# Altium schematic sheet Sheet2.SchDoc
size A0; SheetNumber: 1; SheetTotal: 1
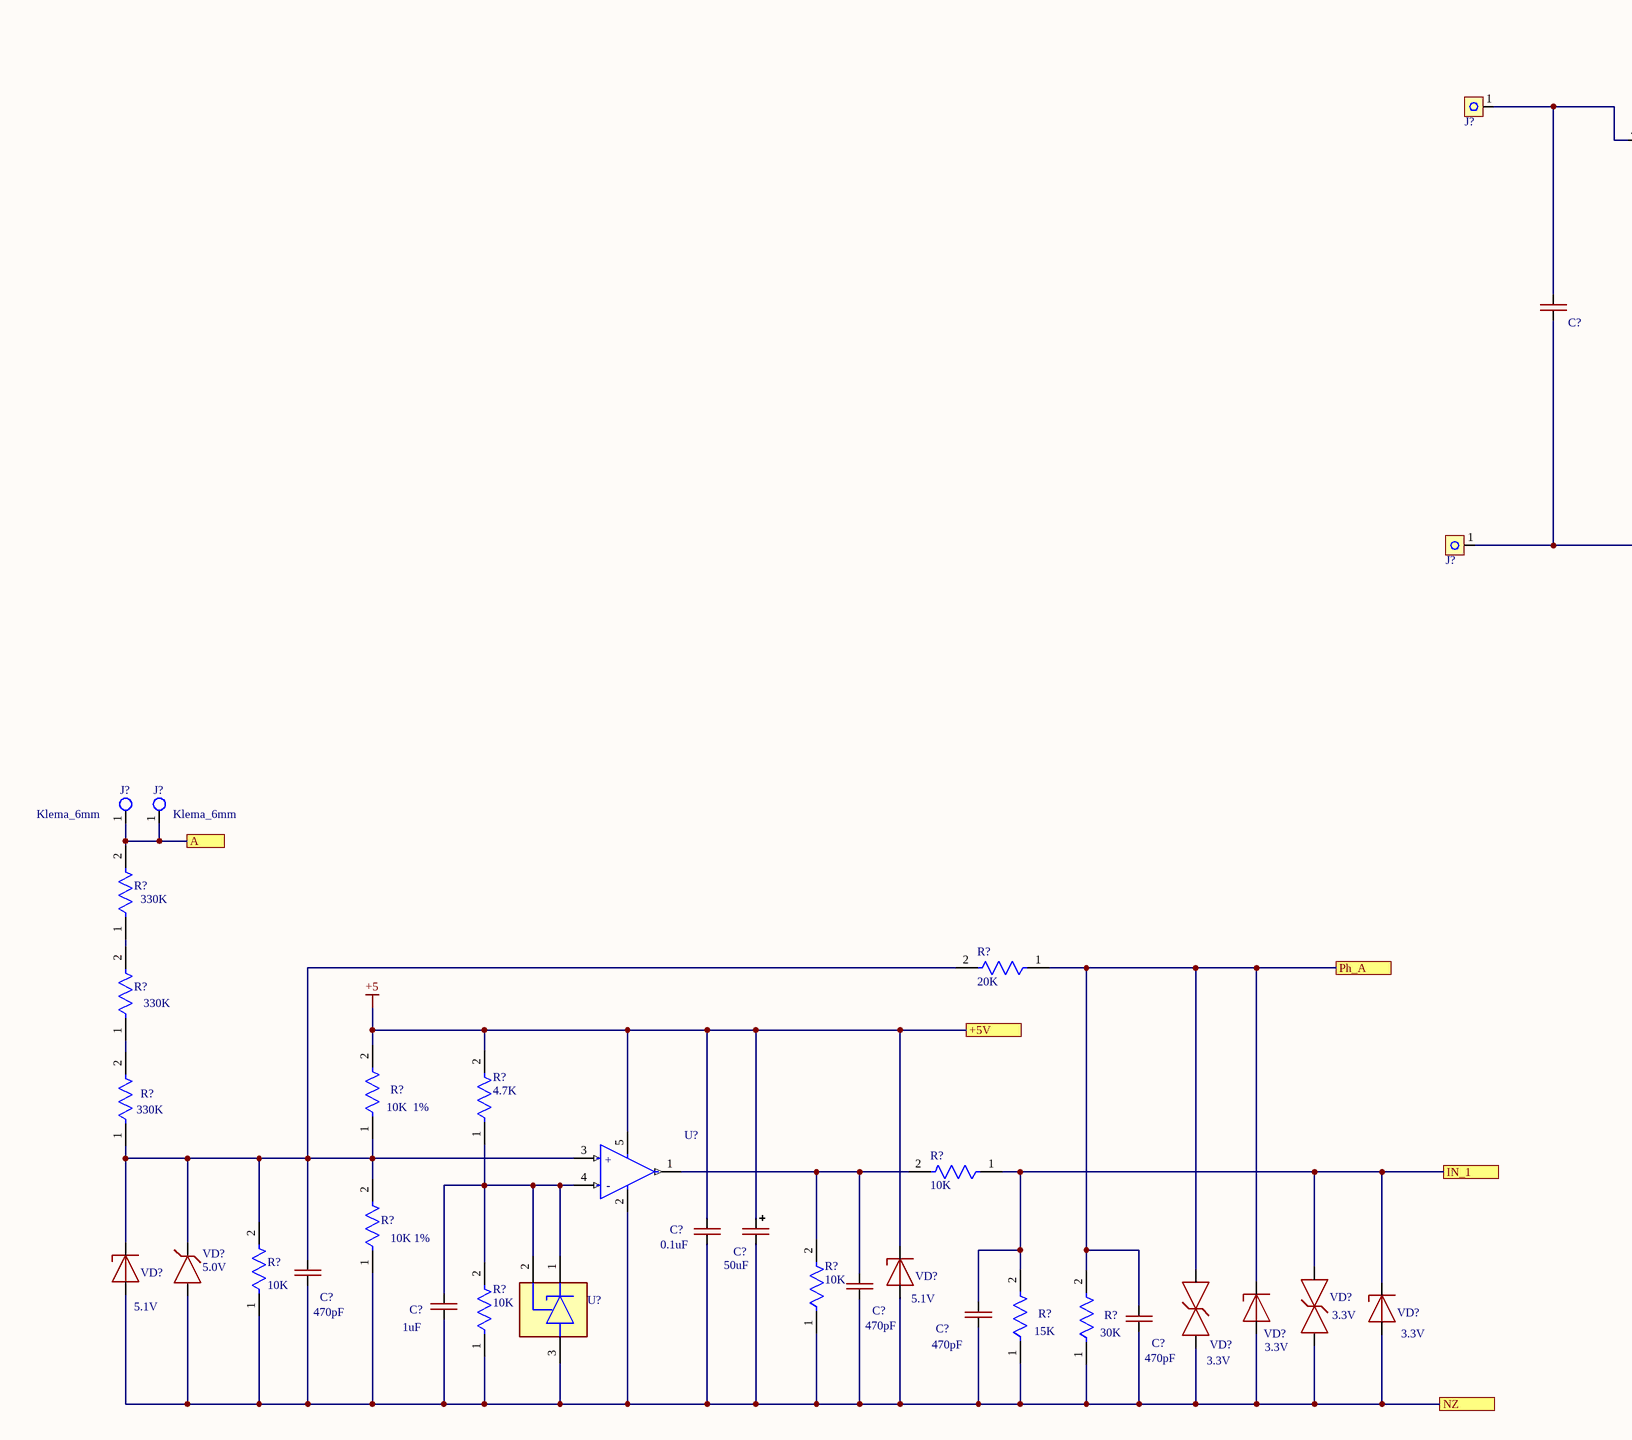
[diagram p0: Sheet2.SchDoc, left]
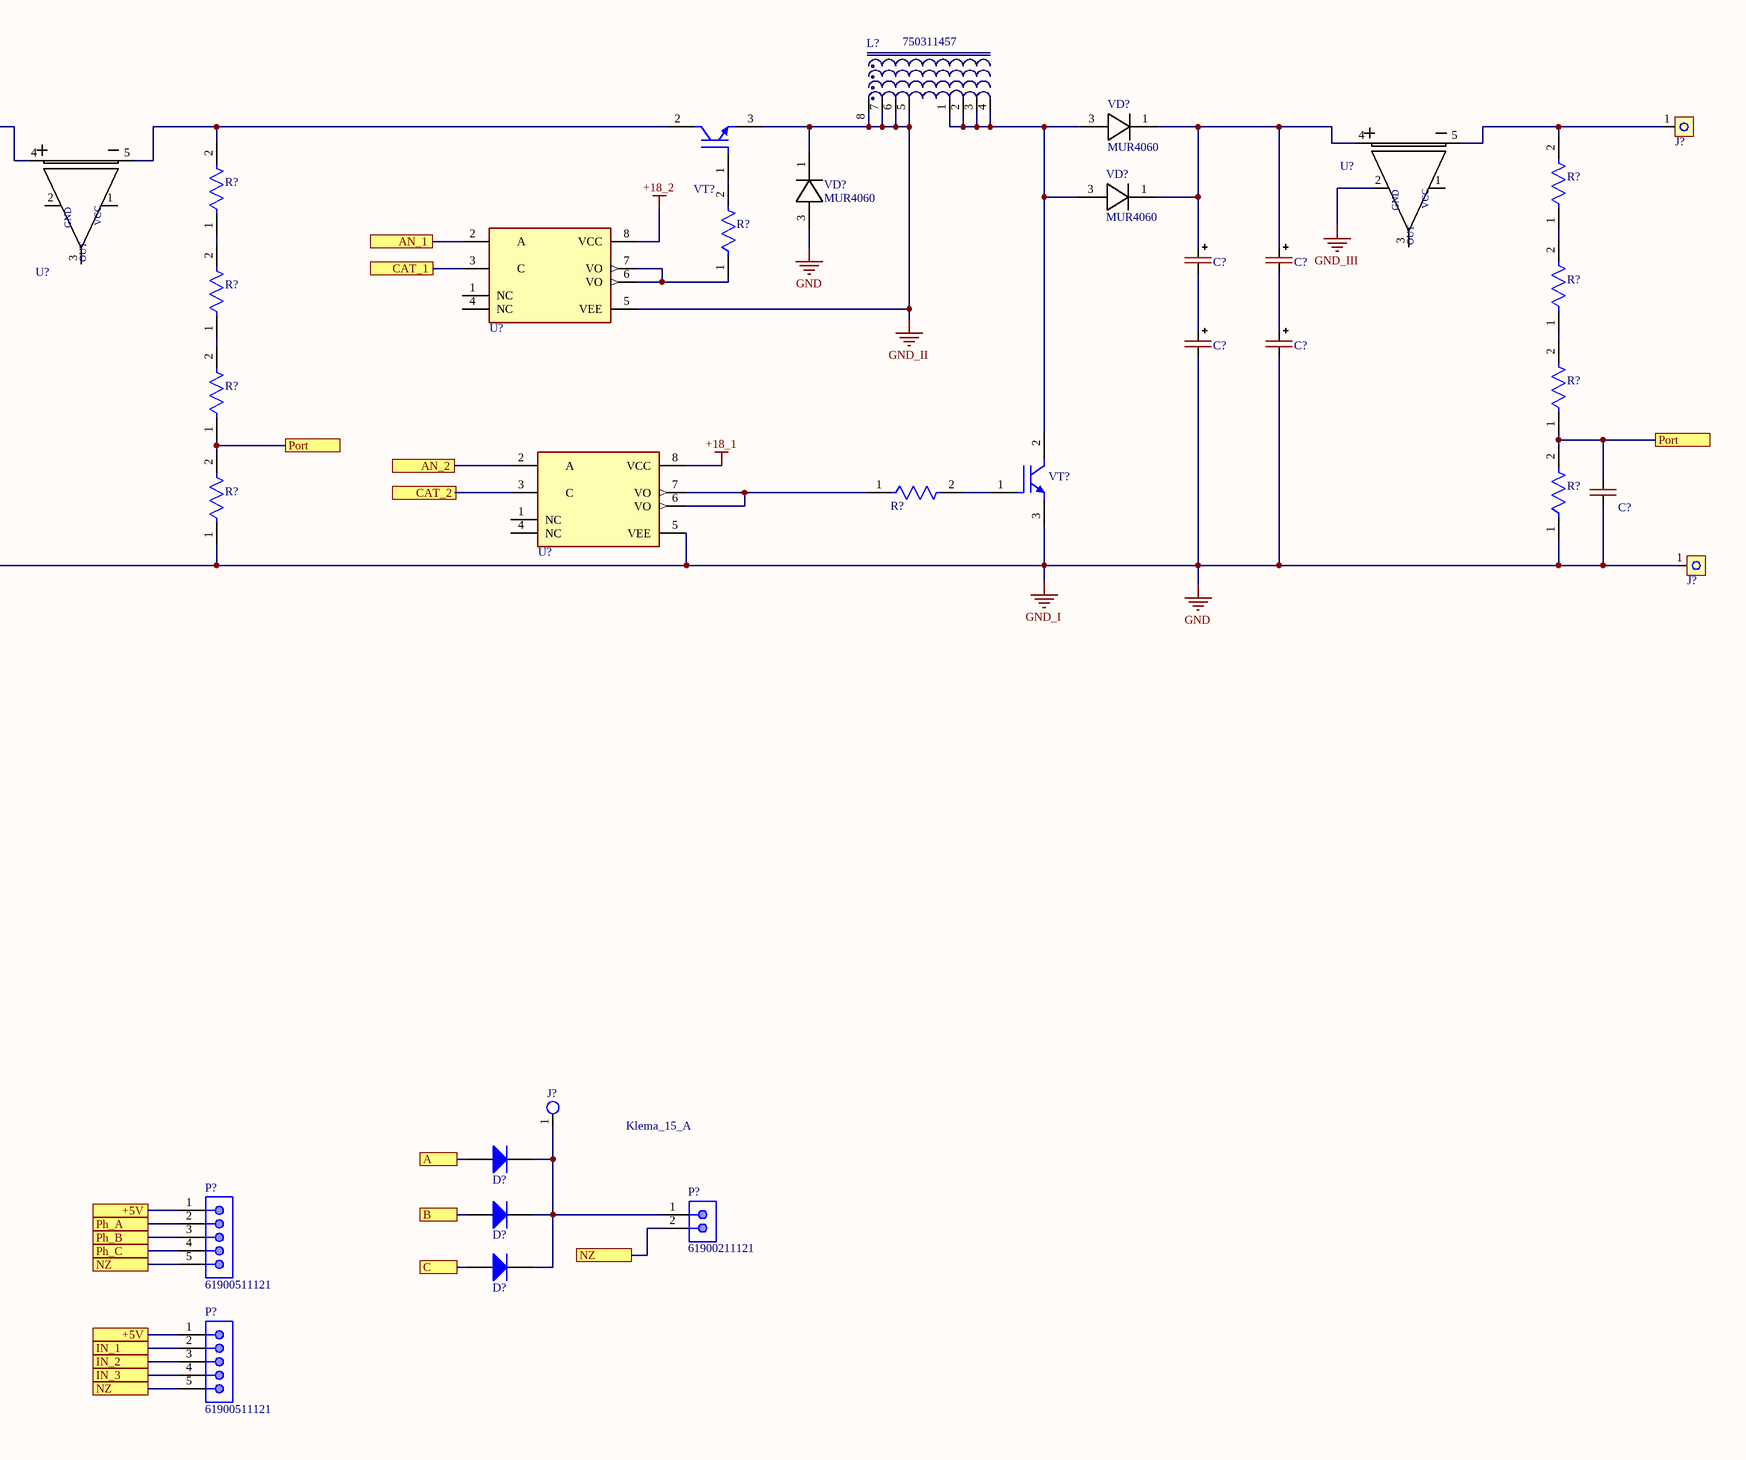
[diagram p1: Sheet2.SchDoc, right]

## Parts
(Parts that share a designator on the sheet are numbered #1, #2 ... from top to bottom, then left to right.)
C?#1  CAP-POLAR  [CAP 100uF_500V 22x40mm]  (value not drawn)
C?#2  CAP-POLAR  [CAP 100uF_500V 22x40mm]  (value not drawn)
C?#3  CAP-NON-POLAR  [CAP_4.7uF_630V]  (value not drawn)
C?#4  CAP-POLAR  [CAP 100uF_500V 22x40mm]  (value not drawn)
C?#5  CAP-POLAR  [CAP 100uF_500V 22x40mm]  (value not drawn)
C?#6  CAP-NON-POLAR  [CAP-0805]  (value not drawn)
C?#7  0.1uF  [CAP-0805]
C?#8  50uF  [CAP-TAN-D]
C?#9  470pF  [CAP-0805]
C?#10  470pF  [CAP-0805]
C?#11  1uF  [CAP-0805]
C?#12  470pF  [CAP-0805]
C?#13  470pF  [CAP-0805]
D?#1  FR-207  [FP-DO-201AD-MFG]  (value not drawn)
D?#2  FR-207  [FP-DO-201AD-MFG]  (value not drawn)
D?#3  FR-207  [FP-DO-201AD-MFG]  (value not drawn)
J?#1  MG_136_HT  [Conn_MEIGAN_MG136HT]  (value not drawn)
J?#2  MG_136_HT  [Conn_MEIGAN_MG136HT]  (value not drawn)
J?#3  MG_136_HT  [Conn_MEIGAN_MG136HT]  (value not drawn)
J?#4  MG_136_HT  [Conn_MEIGAN_MG136HT]  (value not drawn)
J?#5  Klema_6mm  [Connector_6mm]
J?#6  Klema_6mm  [Connector_6mm]
J?#7  Klema_15_A  [Klema_PCB_15A]
L?  750311457  [Drossel]
P?#1  61900511121  [61900511121]
P?#2  61900211121  [61900211121]
P?#3  61900511121  [61900511121]
R?#1  RES_1210  [RES_SMD_1210_IPC_B]  (value not drawn)
R?#2  RES_1210  [RES_SMD_1210_IPC_B]  (value not drawn)
R?#3  RES_1210  [RES_SMD_1210_IPC_B]  (value not drawn)
R?#4  RES_1210  [RES_SMD_1210_IPC_B]  (value not drawn)
R?#5  RES_1210  [RES_SMD_1210_IPC_B]  (value not drawn)
R?#6  RES_1210  [RES_SMD_1210_IPC_B]  (value not drawn)
R?#7  RES_1210  [RES_SMD_1210_IPC_B]  (value not drawn)
R?#8  RES_1210  [RES_SMD_1210_IPC_B]  (value not drawn)
R?#9  RES_1210  [RES_SMD_1210_IPC_B]  (value not drawn)
R?#10  RES_1210  [RES_SMD_1210_IPC_B]  (value not drawn)
R?#11  330K  [RES_SMD_1210_IPC_B]
R?#12  20K  [RES-0805]
R?#13  330K  [RES_SMD_1210_IPC_B]
R?#14  10K  1%  [RES-0805]
R?#15  330K  [RES_SMD_1210_IPC_B]
R?#16  4.7K  [RES-0805]
R?#17  10K  [RES-0805]
R?#18  10K 1%  [RES-0805]
R?#19  10K  [RES_SMD_1210_IPC_B]
R?#20  10K  [RES-0805]
R?#21  10K  [RES-0805]
R?#22  15K  [RES-0805]
R?#23  30K  [RES-0805]
U?#1  HCPL-3120  [HCPL-3120]  (value not drawn)
U?#2  ACS758  [ACS758-100]  (value not drawn)
U?#3  ACS758  [ACS758-100]  (value not drawn)
U?#4  HCPL-3120  [HCPL-3120]  (value not drawn)
U?#5  (no value)  [SOT-23-5]
U?#6  TL431  [TL431_SOT-23-3(A)]  (value not drawn)
VD?#1  MUR4060  [TO-247-2]
VD?#2  MUR4060  [TO-247-2]
VD?#3  MUR4060  [TO-247-2]
VD?#4  5.0V  [SOD-323]
VD?#5  5.1V  [DIOD-SOD123-2_V]
VD?#6  5.1V  [DIOD-SOD123-2_V]
VD?#7  3.3V  [DO-214AA]
VD?#8  3.3V  [DO-214AA]
VD?#9  3.3V  [DIOD-SOD123-2_V]
VD?#10  3.3V  [DIOD-SOD123-2_V]
VT?#1  IGBT 60N120T  [TO-264-3]  (value not drawn)
VT?#2  IGBT 60N120T  [TO-264-3]  (value not drawn)

## Ports
+5V, A, AN_1, AN_2, B, C, CAT_1, CAT_2, IN_1, IN_2, IN_3, NZ, Ph_A, Ph_B, Ph_C, Port

## Nets
+5: C?#7.2 C?#8.1(+) P?#1.1 P?#3.1 R?#14.2 R?#16.2 U?#5.5(VDD) VD?#6.1(C) ; port +5V
+18_1: U?#4.8(VCC)
+18_2: U?#1.8(VCC)
GND: C?#3.1 C?#4.2(-) C?#5.2(-) C?#6.1 J?#3.1 J?#4.1 R?#9.1 R?#10.1 U?#4.5(VEE) VD?#3.3 VT?#2.3(E)  [also labelled GND_I]
GND_II: L?.5 L?.6 L?.7 L?.8 U?#1.5(VEE) VD?#3.1 VT?#1.3(E)
GND_III: U?#2.2(GND)
A: D?#1.2(A) J?#5.1 J?#6.1 R?#11.2 ; port A
AN_1: U?#1.2(A) ; port AN_1
AN_2: U?#4.2(A) ; port AN_2
B: D?#2.2(A) ; port B
C: D?#3.2(A) ; port C
CAT_1: U?#1.3(C) ; port CAT_1
CAT_2: U?#4.3(C) ; port CAT_2
IN_1: C?#12.2 P?#3.2 R?#17.1 R?#22.2 VD?#8.2(A) VD?#10.1(C) ; port IN_1
IN_2: P?#3.3 ; port IN_2
IN_3: P?#3.4 ; port IN_3
NZ: C?#7.1 C?#8.2(-) C?#9.1 C?#10.1 C?#11.1 C?#12.1 C?#13.1 P?#1.5 P?#2.2 P?#3.5 R?#18.1 R?#19.1 R?#20.1 R?#21.1 R?#22.1 R?#23.1 U?#5.2(VSS) U?#6.3(A) VD?#4.1(A) VD?#5.2(A) VD?#6.2(A) VD?#7.1(C) VD?#8.1(C) VD?#9.2(A) VD?#10.2(A) ; port NZ
Ph_A: C?#13.2 P?#1.2 R?#12.1 R?#23.2 VD?#7.2(A) VD?#9.1(C) ; port Ph_A
Ph_B: P?#1.3 ; port Ph_B
Ph_C: P?#1.4 ; port Ph_C
Port: C?#6.2 R?#6.1 R?#7.1 R?#9.2 R?#10.2 ; port Port
NetC?#1_1: C?#1.1(+) C?#2.1(+) U?#2.4(+IP) VD?#1.1 VD?#2.1
NetC?#1_2: C?#1.2(-) C?#4.1(+)
NetC?#2_2: C?#2.2(-) C?#5.1(+)
NetC?#3_2: C?#3.2 J?#1.1 U?#3.4(+IP)
NetC?#9_2: C?#9.2 R?#12.2 R?#14.1 R?#15.1 R?#18.2 R?#19.2 U?#5.3(VIN+) VD?#4.2(C) VD?#5.1(C)
NetC?#10_2: C?#10.2 R?#17.2 R?#20.2 U?#5.1(VOUT)
NetC?#11_2: C?#11.2 R?#16.1 R?#21.2 U?#5.4(VIN-) U?#6.1(C) U?#6.2(REF)
NetD?#1_1: D?#1.1(K) D?#2.1(K) D?#3.1(K) J?#7.1 P?#2.1
NetJ?#2_1: J?#2.1 R?#1.2 U?#2.5(-IP)
NetL?_1: L?.1 L?.2 L?.3 L?.4 VD?#1.3 VD?#2.3 VT?#2.2(C)
NetR?#1_1: R?#1.1 R?#5.2
NetR?#2_1: R?#2.1 R?#4.2
NetR?#2_2: R?#2.2 U?#3.5(-IP) VT?#1.2(C)
NetR?#3_1: R?#3.1 U?#1.6(VO) U?#1.7(VO)
NetR?#3_2: R?#3.2 VT?#1.1(G)
NetR?#4_1: R?#4.1 R?#6.2
NetR?#5_1: R?#5.1 R?#7.2
NetR?#8_1: R?#8.1 U?#4.6(VO) U?#4.7(VO)
NetR?#8_2: R?#8.2 VT?#2.1(G)
NetR?#11_1: R?#11.1 R?#13.2
NetR?#13_1: R?#13.1 R?#15.2

Not connected (* = marked no-connect by the designer): U?#1 1(NC) 4(NC); U?#2 1(+VCC) 3(OUT); U?#3 1(+VCC) 2(GND) 3(OUT); U?#4 1(NC) 4(NC)

## Notes on the sheet
- (in symbol ACS758) VCC
- (in symbol MCP6001T) +; -

## Library data of the parts
C?#7 C?#9-C?#13 = CAP-NON-POLAR
C?#8 = CAP-POLAR
D?#1-D?#3 = FR-207: FR207
J?#1-J?#4 = Connector_MEIGAN_MG136HT
J?#5 J?#6 = Klema_15_A
L? = DROSEL: Manufacturer: Wuerth Elektronik; Ui: 36V; ComponentLink1Description: Manufacturer URL; ComponentLink2Description: Datasheet; ComponentLink1URL: http://www.we-online.com; PartNumber: 750311457; PackageReference: EP13; ComponentLink2URL: http://katalog.we-online.de/pbs/datasheet/750311457.pdf
P?#1 P?#3 = 61900511121: WR-WTB THT Male Vertical Locking Header, pitch 2.54mm, 5p; Pin Number: 5; Contact Resistance: 20mOhm; Rated Current: 3A; Withstanding Voltage: 1000VAC; Working Voltage: 250VAC; ComponentLink1Description: Manufacturer; ComponentLink1URL: http://www.we-online.de; ComponentLink2Description: Datasheet; ComponentLink2URL: https://www.we-online.com/catalog/datasheet/61900511121.pdf; Pitch: 2.54mm; Published Date: January 2020; Publisher: Wurth Elektronik; Mounting Technology: THT; Packaging: Bag; Operating Temperature: -40 to +105degC; Part Number: 61900511121; Gender: Male; Type: Vertical
P?#2 = 61900211121: WR-WTB THT Male Vertical Locking Header, pitch 2.54mm, 2p; Pin Number: 2; Contact Resistance: 20mOhm; Rated Current: 3A; Withstanding Voltage: 1000VAC; Working Voltage: 250VAC; ComponentLink1Description: Manufacturer; ComponentLink1URL: http://www.we-online.de; ComponentLink2Description: Datasheet; ComponentLink2URL: https://www.we-online.com/catalog/datasheet/61900211121.pdf; Pitch: 2.54mm; Published Date: January 2020; Publisher: Wurth Elektronik; Mounting Technology: THT; Packaging: Bag; Operating Temperature: -40 to +105degC; Part Number: 61900211121; Gender: Male; Type: Vertical
R?#11 R?#13 R?#15 R?#19 = RES_1210
R?#12 R?#16 R?#17 R?#20-R?#23 = RES-CONST
R?#14 R?#18 = RES-CONST: 10K
U?#5 = MCP6001T: IC OPAMP GP 1 CIRCUIT SOT23-5; Number of Amplifiers: 1; Voltage: 6V; Power Supply Rejection Ratio (PSRR): 86dB; Common Mode Rejection Ratio: 60dB; Unity Gain Bandwidth Product: 1MHz; Slew Rate: 0.6V/µs; Output Current per Channel: 23mA; Nominal Supply Current: 100uA; Input Offset Voltage (Vos): 4.5mV; Input Bias Current: 1pA; Operating Supply Voltage: 5.5V; Min Supply Voltage: 1.8V; Voltage Gain: 112dB; Length: 3.1mm; REACH SVHC: No SVHC; Number of Pins: 5; Package Quantity: 1; Radiation Hardening: No; Mount: Surface Mount; Number of Circuits: 1; Number of Elements: 1; Output Current: 23mA; Packaging: Tape and Reel; Height: 1.3mm; Lead Free: Lead Free; Min Operating Temperature: -40°C; Bandwidth: 1MHz; Contact Plating: Tin; Max Supply Voltage: 6V; Max Operating Temperature: 85°C; Width: 1.8mm; Case/Package: SOT-23; Operating Supply Current: 100uA; Number of Channels: 1; Gain Bandwidth Product: 1MHz
U?#6 = TL431_SOT-23-3
VD?#4 = SMBJ15A
VD?#5 VD?#6 VD?#9 VD?#10 = ZENER
VD?#7 VD?#8 = Suppressor
VT?#1 VT?#2 = IGBT 60N120T: IGBT 60N120T TO-264-3